# EAGLE design R-Divider-Breakout (EAGLE 7.6.0)
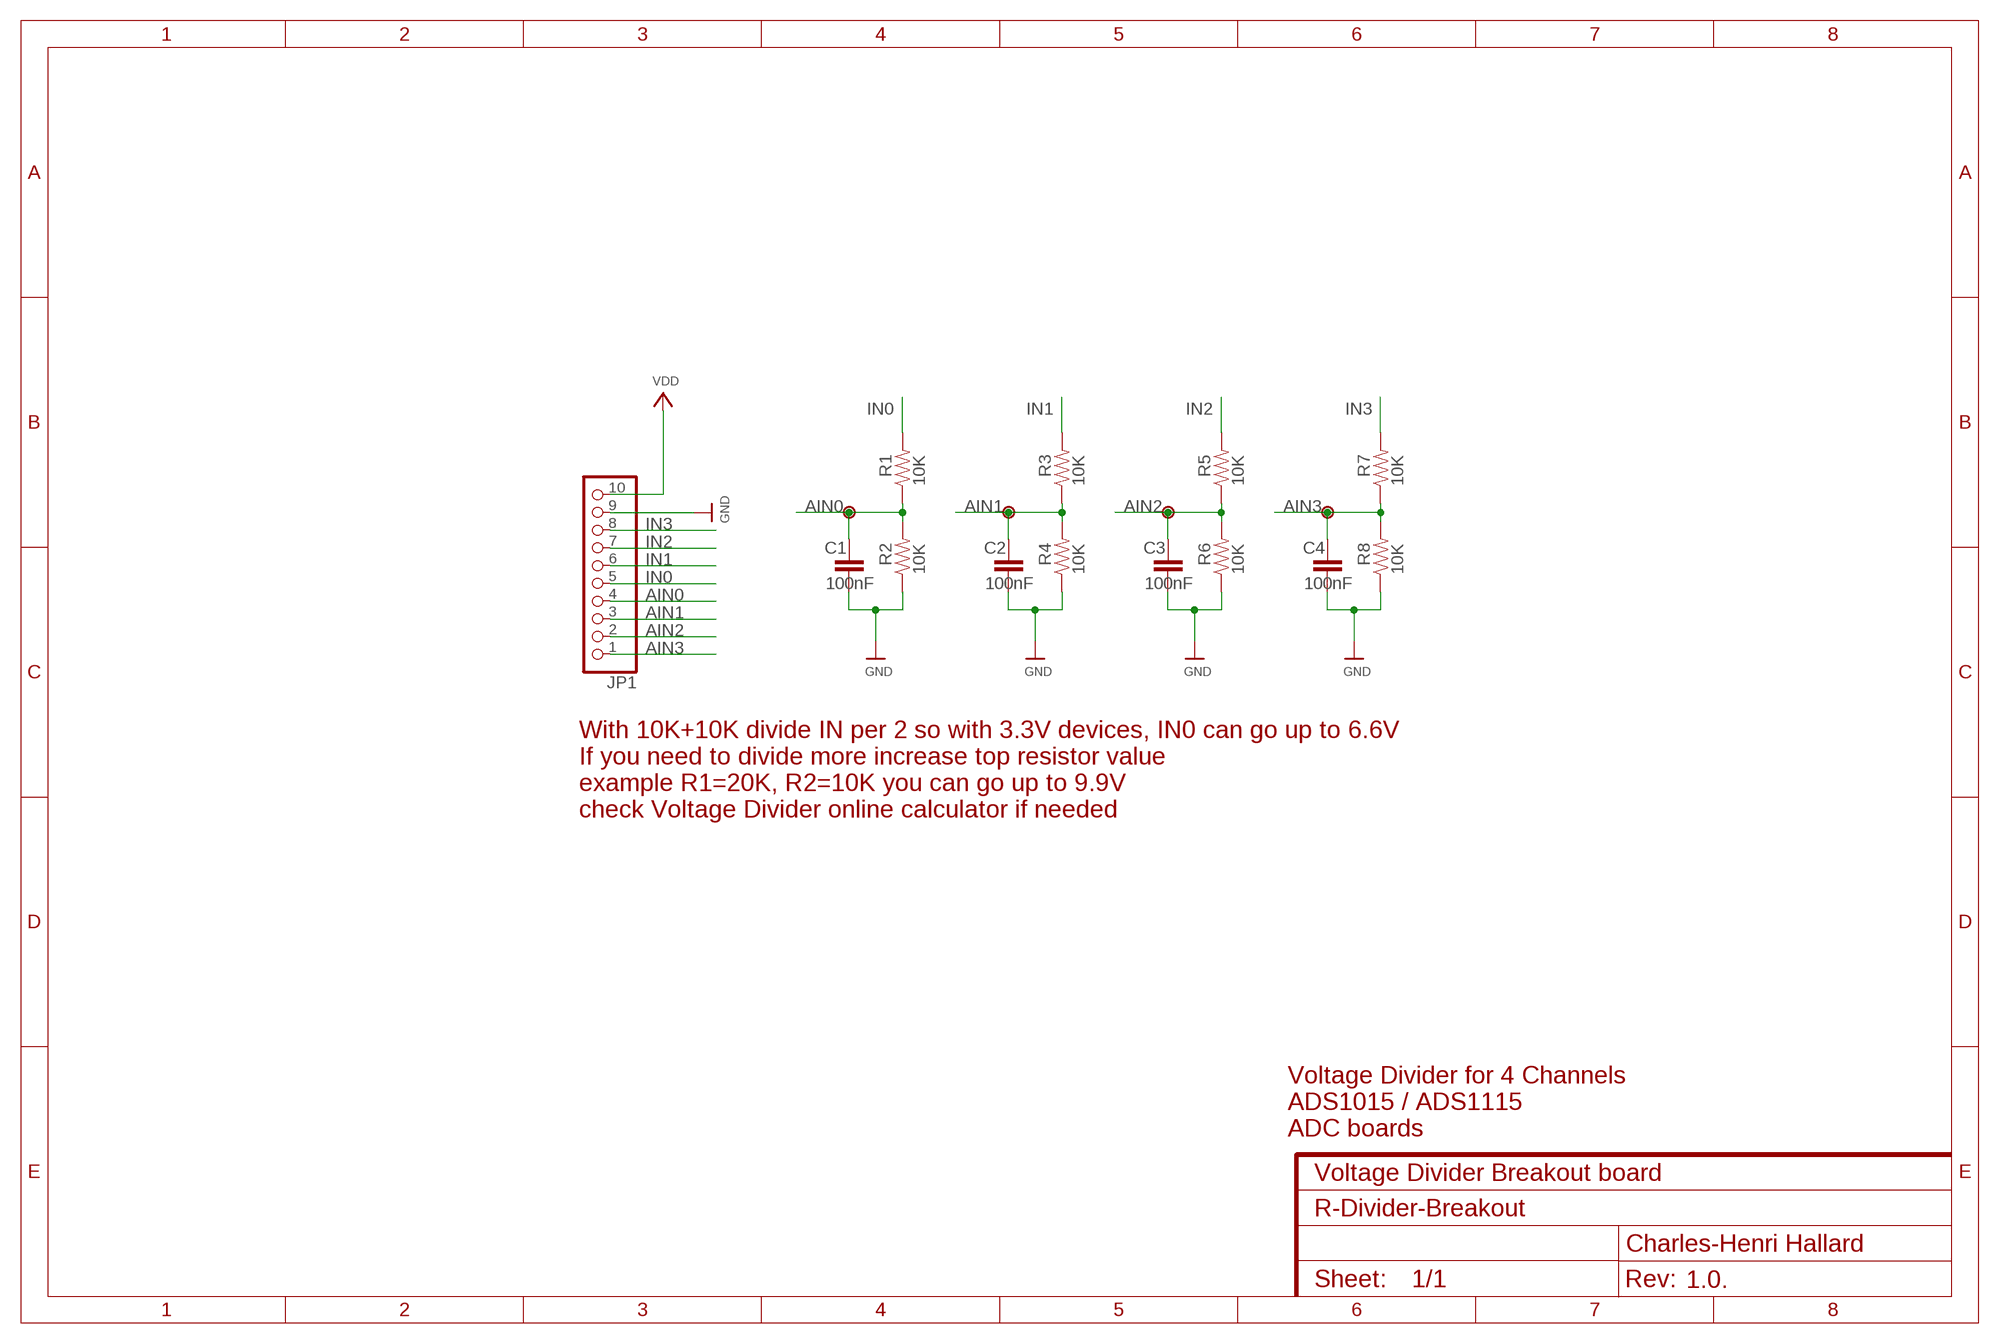
[diagram p0: schematic, sheet 1]
NAME (FRAME-A4L): CNAME: Voltage Divider Breakout board; CREVISION: 1.0.; DESIGNER: Charles-Henri Hallard

## Parts
C1  100nF  CAP0805-CAP  [0805-CAP]
C2  100nF  CAP0805-CAP  [0805-CAP]
C3  100nF  CAP0805-CAP  [0805-CAP]
C4  100nF  CAP0805-CAP  [0805-CAP]
JP1  HEADER-1X1070MIL  [1X10_ROUND70]
P1  PADSMALL  [PAD-SMALL]
P2  PADSMALL  [PAD-SMALL]
P3  PADSMALL  [PAD-SMALL]
P4  PADSMALL  [PAD-SMALL]
R1  10K  RESISTOR0805-RES  [0805-RES]
R2  10K  RESISTOR0805-RES  [0805-RES]
R3  10K  RESISTOR0805-RES  [0805-RES]
R4  10K  RESISTOR0805-RES  [0805-RES]
R5  10K  RESISTOR0805-RES  [0805-RES]
R6  10K  RESISTOR0805-RES  [0805-RES]
R7  10K  RESISTOR0805-RES  [0805-RES]
R8  10K  RESISTOR0805-RES  [0805-RES]

## Nets
AIN0: C1.1 JP1.4 P1.1 R1.1 R2.2
AIN1: C2.1 JP1.3 P2.1 R3.1 R4.2
AIN2: C3.1 JP1.2 P3.1 R5.1 R6.2
AIN3: C4.1 JP1.1 P4.1 R7.1 R8.2
GND: C1.2 C2.2 C3.2 C4.2 JP1.9 R2.1 R4.1 R6.1 R8.1
IN0: JP1.5 R1.2
IN1: JP1.6 R3.2
IN2: JP1.7 R5.2
IN3: JP1.8 R7.2
VDD: JP1.10

## Notes on the sheet
- With 10K+10K divide IN per 2 so with 3.3V devices, IN0 can go up to 6.6V
  If you need to divide more increase top resistor value
  example R1=20K, R2=10K you can go up to 9.9V
  check Voltage Divider online calculator if needed
- Voltage Divider for 4 Channels
  ADS1015 / ADS1115
  ADC boards

## Library data of the parts
C1-C4 = _c2h:CAP: Capacitor Standard 0603 ceramic capacitor, and 0.1" leaded capacitor.
JP1 = microbuilder:HEADER-1X10: PIN HEADER
P1-P4 = _c2h:PAD
R1-R8 = _c2h:RESISTOR: Resistor Basic schematic elements and footprints for 0603, 1206, and PTH resistors.

## Board
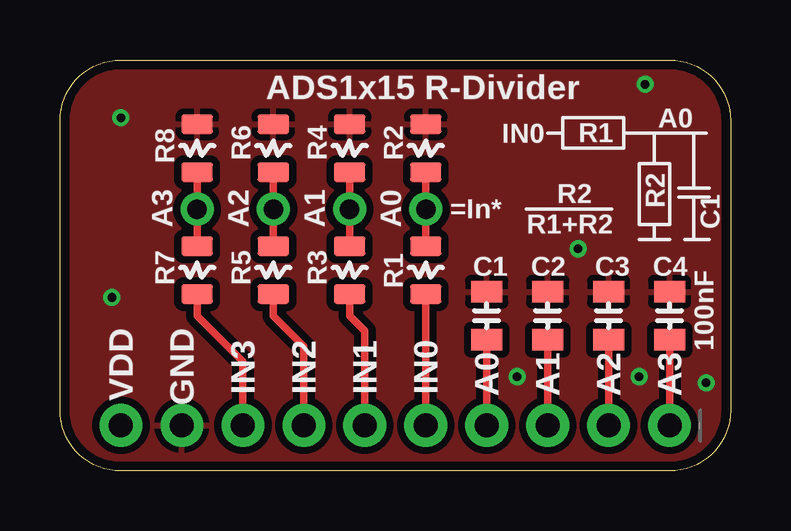
[diagram p1: board, top side]
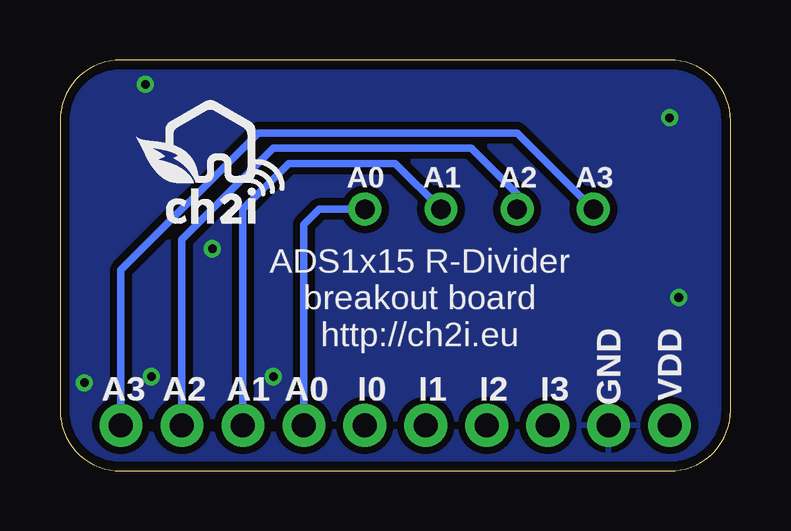
[diagram p2: board, bottom side, seen from below]

Size 27.94 x 17.14 mm. Coordinates in mm from the lower left corner, seen from the top.
Outline: 27.94,14.61 27.94,2.54 arc-90 25.4,0 2.54,0 arc-90 0,2.54 0,14.61 arc-90 2.54,17.14 25.4,17.14 arc-90 27.94,14.61
Copper layers (1*16): Top 0.0356mm / dielectric 1.5011mm / Bottom 0.0356mm
Design rules "PCBs_io": minimum track width 6mil, minimum drill 13mil, track to track 6mil, track to pad 6mil, pad to pad 6mil, via to via 6mil, smd to smd 6mil, copper to edge 15mil, drill to drill 6mil, minimum pad ring 7mil, minimum via ring 7mil, stop-mask expansion 3mil, vias tented up to drill 40mil, thermal gap 10mil

### Footprints (pad centres in the part's own frame; a part is rotated, then mirrored left to right if it is on the bottom)
0805-CAP = smd 0.902 x 1.3: 1 -1,0; 2 1,0
1X10_ROUND70 = drill 1 pad 1.778: 1 -11.43,0; 2 -8.89,0; 3 -6.35,0; 4 -3.81,0; 5 -1.27,0; 6 1.27,0; 7 3.81,0; 8 6.35,0; 9 8.89,0; 10 11.43,0
PAD-SMALL = drill 0.813 pad 1.372: 1 0,0
0805-RES = smd 0.8 x 1.3: 1 -1,0; 2 1,0

### Placement (x,y rotation side)
C1  17.78,6.48 90 top
C2  20.32,6.48 90 top
C3  22.86,6.48 90 top
C4  25.4,6.48 90 top
JP1  13.97,1.91 180 top
P1  15.24,10.92 0 top
P2  12.06,10.92 0 top
P3  8.89,10.92 0 top
P4  5.71,10.92 0 top
R1  15.24,8.38 270 top
R2  15.24,13.46 270 top
R3  12.06,8.38 270 top
R4  12.06,13.46 270 top
R5  8.89,8.38 270 top
R6  8.89,13.46 270 top
R7  5.71,8.38 270 top
R8  5.71,13.46 270 top
U$5  [LOGO_C2I_015]  24.77,10.29 0 bottom

### Tracks (layer width: path | path; a pad name or v marks a point on that pad's centre or on a via)
AIN0
  Top 0.305: C1.1 JP1.4 | R1.1 P1.1 R2.2
  Bottom 0.305: P1.1 17.14,10.92 17.78,10.29 JP1.4
AIN1
  Top 0.305: JP1.3 C2.1 20.05,5.48 | R4.2 P2.1 R3.1
  Bottom 0.305: 20.32,2.67 JP1.3 20.32,10.92 18.41,12.83 13.97,12.83 P2.1
AIN2
  Top 0.305: C3.1 JP1.2 | R6.2 P3.1 R5.1
  Bottom 0.305: P3.1 8.89,11.56 10.79,13.46 19.05,13.46 22.86,9.65 JP1.2
AIN3
  Top 0.305: C4.1 JP1.1 | R8.2 P4.1 R7.1
  Bottom 0.305: P4.1 8.89,14.1 19.68,14.1 25.4,8.38 JP1.1
GND  (via drill 0.36 pad 0.71)
  other vias: 2.54,14.73 26.92,3.68 21.59,9.27 24.13,3.94 19.05,3.94 2.16,7.24 24.38,16.13
  pour Bottom (isolate 0.305): 29.84,18.41 29.84,-1.27 -1.27,-1.27 -1.27,18.41
  pour Top (isolate 0.305): -0.64,17.91 28.57,17.91 28.57,-0.51 -0.64,-0.51
IN0
  Top 0.305: JP1.5 R1.2
IN1
  Top 0.305: R3.2 12.06,6.48 12.7,5.84 JP1.6
IN2
  Top 0.305: R5.2 8.89,6.48 10.16,5.21 JP1.7
IN3
  Top 0.305: R7.2 5.71,6.48 7.62,4.57 JP1.8

### Text on the board
tPlace: ADS1x15 R-Divider | A0 | IN0 | R1 | R2 | R2 | C1 | A3 | A2 | A1 | A0 | =In* | R1+R2 | VDD | GND | IN3 | IN2 | IN1 | IN0 | A0 | A1 | A2 | A3
bPlace: A3 | A2 | A1 | A0 | ADS1x15 R-Divider / breakout board / http://ch2i.eu | VDD | GND | I3 | I2 | I1 | I0 | A0 | A1 | A2 | A3